# EAGLE schematic SE-Exp30 (EAGLE 9.6.2)
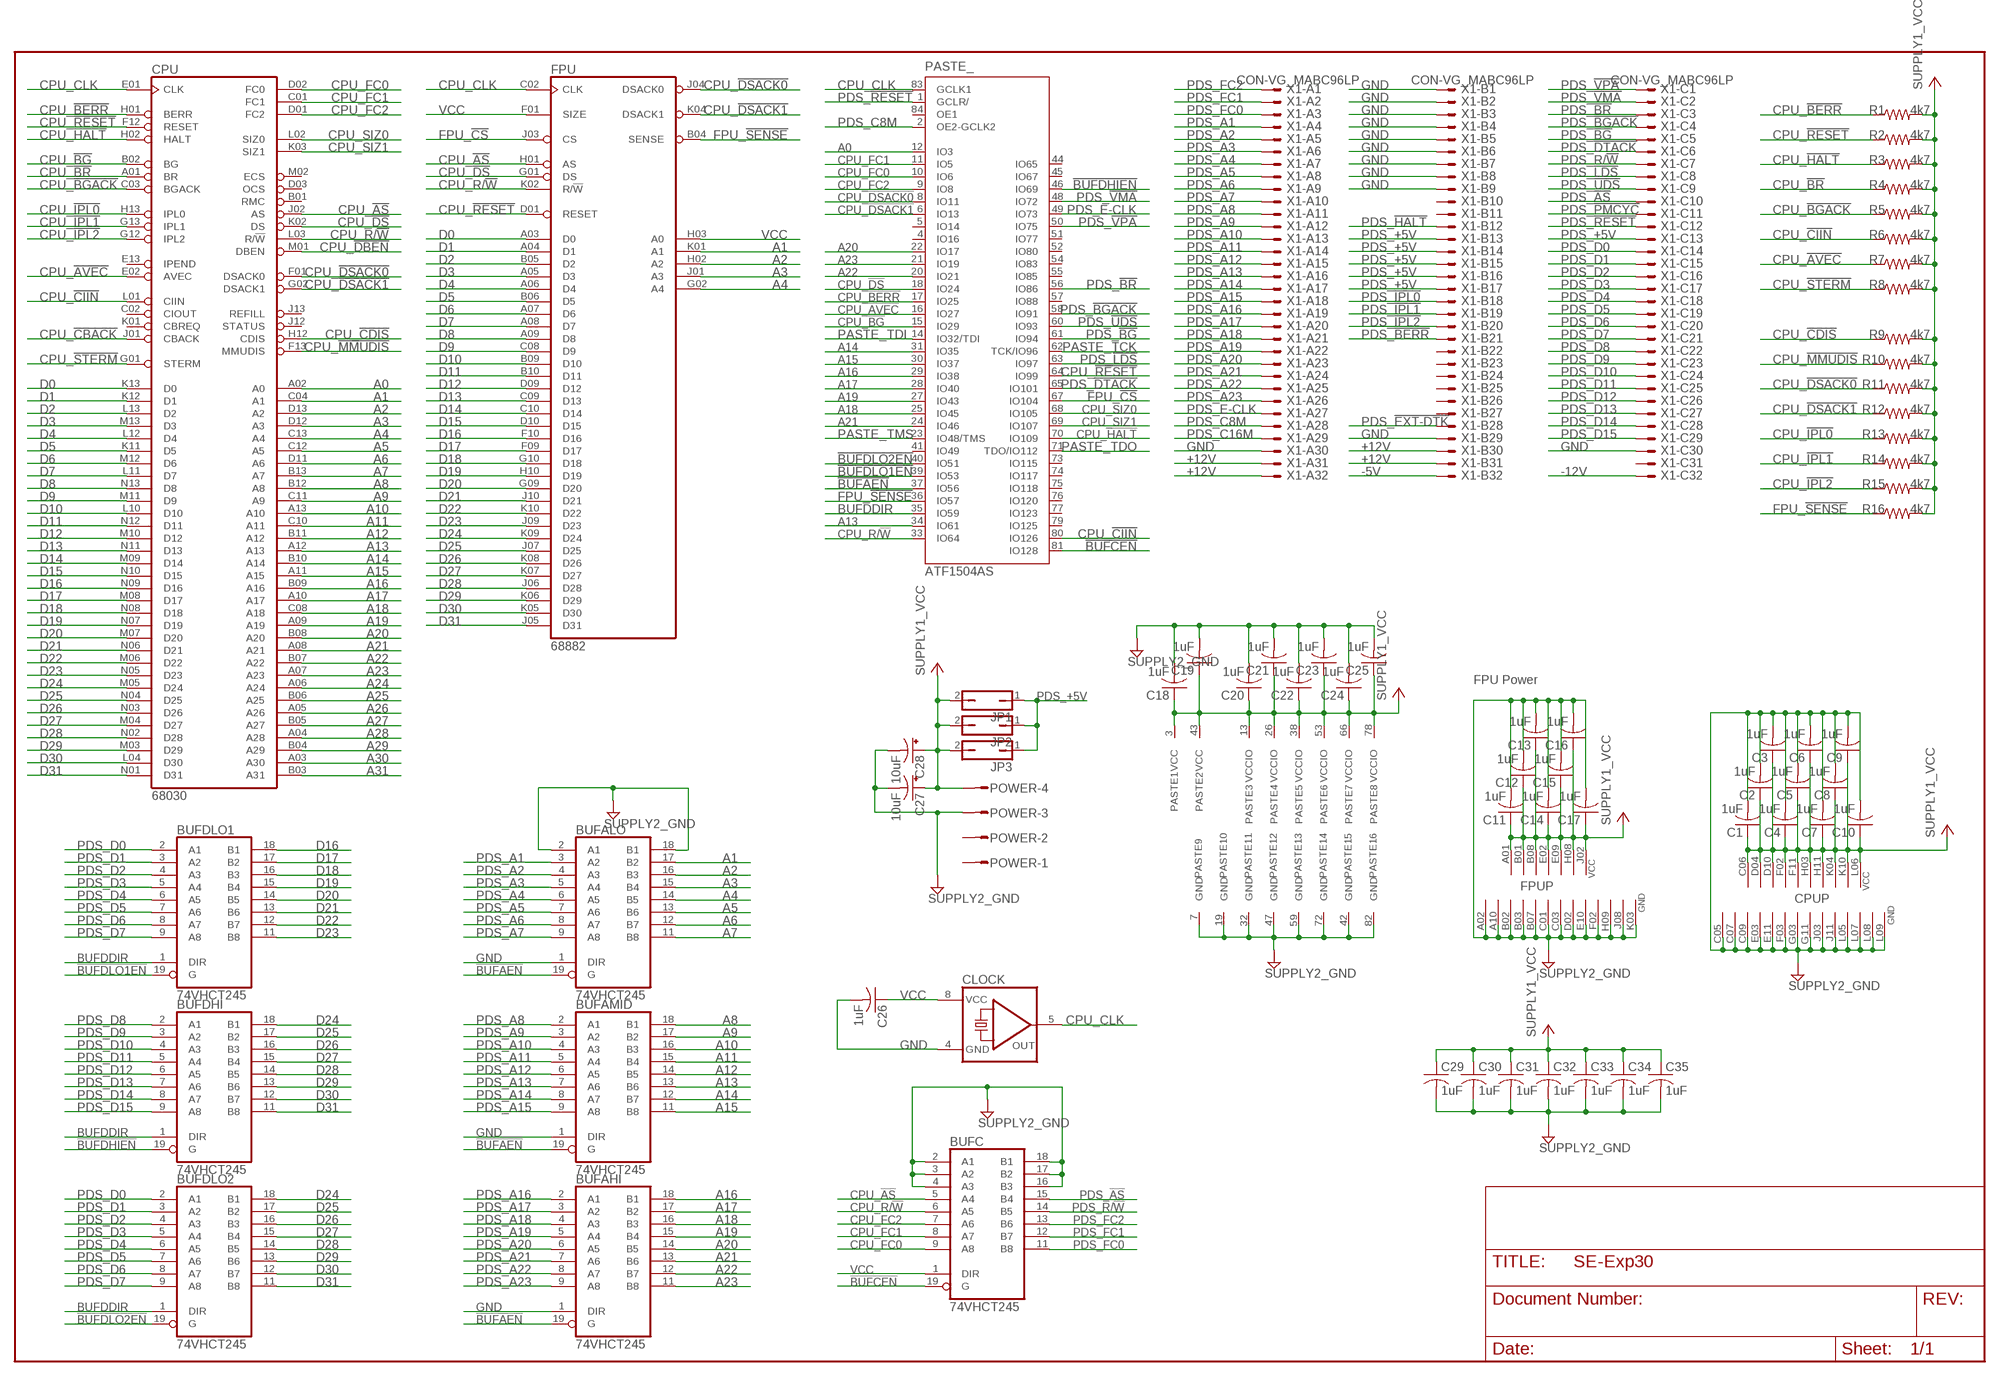
[diagram p0: schematic, sheet 1]

## Parts
BUFAHI  74VHCT245  74XX-US_74LS245DW  [74XX-US_SO20W]
BUFALO  74VHCT245  74XX-US_74LS245DW  [74XX-US_SO20W]
BUFAMID  74VHCT245  74XX-US_74LS245DW  [74XX-US_SO20W]
BUFC  74VHCT245  74XX-US_74LS245DW  [74XX-US_SO20W]
BUFDHI  74VHCT245  74XX-US_74LS245DW  [74XX-US_SO20W]
BUFDLO1  74VHCT245  74XX-US_74LS245DW  [74XX-US_SO20W]
BUFDLO2  74VHCT245  74XX-US_74LS245DW  [74XX-US_SO20W]
C1  1uF  RCL_C-USC0805  [RCL_C0805]
C2  1uF  RCL_C-USC0805  [RCL_C0805]
C3  1uF  RCL_C-USC0805  [RCL_C0805]
C4  1uF  RCL_C-USC0805  [RCL_C0805]
C5  1uF  RCL_C-USC0805  [RCL_C0805]
C6  1uF  RCL_C-USC0805  [RCL_C0805]
C7  1uF  RCL_C-USC0805  [RCL_C0805]
C8  1uF  RCL_C-USC0805  [RCL_C0805]
C9  1uF  RCL_C-USC0805  [RCL_C0805]
C10  1uF  RCL_C-USC0805  [RCL_C0805]
C11  1uF  RCL_C-USC0805  [RCL_C0805]
C12  1uF  RCL_C-USC0805  [RCL_C0805]
C13  1uF  RCL_C-USC0805  [RCL_C0805]
C14  1uF  RCL_C-USC0805  [RCL_C0805]
C15  1uF  RCL_C-USC0805  [RCL_C0805]
C16  1uF  RCL_C-USC0805  [RCL_C0805]
C17  1uF  RCL_C-USC0805  [RCL_C0805]
C18  1uF  RCL_C-USC0805  [RCL_C0805]
C19  1uF  RCL_C-USC0805  [RCL_C0805]
C20  1uF  RCL_C-USC0805  [RCL_C0805]
C21  1uF  RCL_C-USC0805  [RCL_C0805]
C22  1uF  RCL_C-USC0805  [RCL_C0805]
C23  1uF  RCL_C-USC0805  [RCL_C0805]
C24  1uF  RCL_C-USC0805  [RCL_C0805]
C25  1uF  RCL_C-USC0805  [RCL_C0805]
C26  1uF  RCL_C-USC0805  [RCL_C0805]
C27  10uF  RCL_CPOL-USE2.5-5  [RCL_E2,5-5]
C28  10uF  RCL_CPOL-USE2.5-5  [RCL_E2,5-5]
C29  1uF  RCL_C-USC0805  [RCL_C0805]
C30  1uF  RCL_C-USC0805  [RCL_C0805]
C31  1uF  RCL_C-USC0805  [RCL_C0805]
C32  1uF  RCL_C-USC0805  [RCL_C0805]
C33  1uF  RCL_C-USC0805  [RCL_C0805]
C34  1uF  RCL_C-USC0805  [RCL_C0805]
C35  1uF  RCL_C-USC0805  [RCL_C0805]
CLOCK  CRYSTAL_QG5460  [CRYSTAL_DIL08S]
CPU  68030  MICRO-MC68000_MC68030RC  [MICRO-MC68000_MPGA128]
FPU  68882  MICRO-MC68000_MC68881RC  [MICRO-MC68000_MPGA68]
JP1  JUMPER_JP1Q  [JUMPER_JP1]
JP2  JUMPER_JP1Q  [JUMPER_JP1]
JP3  JUMPER_JP1Q  [JUMPER_JP1]
PASTE  ATF1504AS  SE-EXP30_EPM7128-J84S  [SE-EXP30_S84]
POWER  CON-AMP-MT_L04P  [CON-AMP-MT_L04P]
R1  4k7  RCL_R-US_R0805  [RCL_R0805]
R2  4k7  RCL_R-US_R0805  [RCL_R0805]
R3  4k7  RCL_R-US_R0805  [RCL_R0805]
R4  4k7  RCL_R-US_R0805  [RCL_R0805]
R5  4k7  RCL_R-US_R0805  [RCL_R0805]
R6  4k7  RCL_R-US_R0805  [RCL_R0805]
R7  4k7  RCL_R-US_R0805  [RCL_R0805]
R8  4k7  RCL_R-US_R0805  [RCL_R0805]
R9  4k7  RCL_R-US_R0805  [RCL_R0805]
R10  4k7  RCL_R-US_R0805  [RCL_R0805]
R11  4k7  RCL_R-US_R0805  [RCL_R0805]
R12  4k7  RCL_R-US_R0805  [RCL_R0805]
R13  4k7  RCL_R-US_R0805  [RCL_R0805]
R14  4k7  RCL_R-US_R0805  [RCL_R0805]
R15  4k7  RCL_R-US_R0805  [RCL_R0805]
R16  4k7  RCL_R-US_R0805  [RCL_R0805]
X1  CON-VG_MABC96LP  [CON-VG_MABC96LP]

## Nets
!BUFAEN: BUFAHI.19(G) BUFALO.19(G) BUFAMID.19(G) PASTE.37(_:IO56)
!BUFCEN: BUFC.19(G) PASTE.81(_:IO128)
!BUFDHIEN: BUFDHI.19(G) PASTE.46(_:IO69)
!BUFDLO1EN: BUFDLO1.19(G) PASTE.39(_:IO53)
!BUFDLO2EN: BUFDLO2.19(G) PASTE.40(_:IO51)
+12V: X1.A31 X1.A32 X1.B30 X1.B31
-5V: X1.B32
-12V: X1.C32
A0: CPU.A02(A0) PASTE.12(_:IO3)
A1: BUFALO.17(B2) CPU.C04(A1) FPU.K01(A1)
A2: BUFALO.16(B3) CPU.D13(A2) FPU.H02(A2)
A3: BUFALO.15(B4) CPU.D12(A3) FPU.J01(A3)
A4: BUFALO.14(B5) CPU.C13(A4) FPU.G02(A4)
A5: BUFALO.13(B6) CPU.C12(A5)
A6: BUFALO.12(B7) CPU.D11(A6)
A7: BUFALO.11(B8) CPU.B13(A7)
A8: BUFAMID.18(B1) CPU.B12(A8)
A9: BUFAMID.17(B2) CPU.C11(A9)
A10: BUFAMID.16(B3) CPU.A13(A10)
A11: BUFAMID.15(B4) CPU.C10(A11)
A12: BUFAMID.14(B5) CPU.B11(A12)
A13: BUFAMID.13(B6) CPU.A12(A13) PASTE.34(_:IO61)
A14: BUFAMID.12(B7) CPU.B10(A14) PASTE.31(_:IO35)
A15: BUFAMID.11(B8) CPU.A11(A15) PASTE.30(_:IO37)
A16: BUFAHI.18(B1) CPU.B09(A16) PASTE.29(_:IO38)
A17: BUFAHI.17(B2) CPU.A10(A17) PASTE.28(_:IO40)
A18: BUFAHI.16(B3) CPU.C08(A18) PASTE.25(_:IO45)
A19: BUFAHI.15(B4) CPU.A09(A19) PASTE.27(_:IO43)
A20: BUFAHI.14(B5) CPU.B08(A20) PASTE.22(_:IO17)
A21: BUFAHI.13(B6) CPU.A08(A21) PASTE.24(_:IO46)
A22: BUFAHI.12(B7) CPU.B07(A22) PASTE.20(_:IO21)
A23: BUFAHI.11(B8) CPU.A07(A23) PASTE.21(_:IO19)
A24: CPU.A06(A24)
A25: CPU.B06(A25)
A26: CPU.A05(A26)
A27: CPU.B05(A27)
A28: CPU.A04(A28)
A29: CPU.B04(A29)
A30: CPU.A03(A30)
A31: CPU.B03(A31)
BUFDDIR: BUFDHI.1(DIR) BUFDLO1.1(DIR) BUFDLO2.1(DIR) PASTE.35(_:IO59)
CPU_!AS: BUFC.5(A4) CPU.J02(AS) FPU.H01(AS)
CPU_!AVEC: CPU.E02(AVEC) PASTE.16(_:IO27) R7.1
CPU_!BERR: CPU.H01(BERR) PASTE.17(_:IO25) R1.1
CPU_!BG: CPU.B02(BG) PASTE.15(_:IO29)
CPU_!BGACK: CPU.C03(BGACK) R5.1
CPU_!BR: CPU.A01(BR) R4.1
CPU_!CBACK: CPU.J01(CBACK)
CPU_!CDIS: CPU.H12(CDIS) R9.1
CPU_!CIIN: CPU.L01(CIIN) PASTE.80(_:IO126) R6.1
CPU_!DBEN: CPU.M01(DBEN)
CPU_!DS: CPU.K02(DS) FPU.G01(DS) PASTE.18(_:IO24)
CPU_!DSACK0: CPU.F01(DSACK0) FPU.J04(DSACK0) PASTE.8(_:IO11) R11.1
CPU_!DSACK1: CPU.G02(DSACK1) FPU.K04(DSACK1) PASTE.6(_:IO13) R12.1
CPU_!HALT: CPU.H02(HALT) PASTE.70(_:IO109) R3.1
CPU_!IPL0: CPU.H13(IPL0) R13.1
CPU_!IPL1: CPU.G13(IPL1) R14.1
CPU_!IPL2: CPU.G12(IPL2) R15.1
CPU_!MMUDIS: CPU.F13(MMUDIS) R10.1
CPU_!RESET: CPU.F12(RESET) FPU.D01(RESET) PASTE.64(_:IO99) R2.1
CPU_!STERM: CPU.G01(STERM) R8.1
CPU_CLK: CLOCK.5(OUT) CPU.E01(CLK) FPU.C02(CLK) PASTE.83(_:GCLK1)
CPU_FC0: BUFC.9(A8) CPU.D02(FC0) PASTE.10(_:IO6)
CPU_FC1: BUFC.8(A7) CPU.C01(FC1) PASTE.11(_:IO5)
CPU_FC2: BUFC.7(A6) CPU.D01(FC2) PASTE.9(_:IO8)
CPU_R/!W: BUFC.6(A5) CPU.L03(R/!W) FPU.K02(R/!W) PASTE.33(_:IO64)
CPU_SIZ0: CPU.L02(SIZ0) PASTE.68(_:IO105)
CPU_SIZ1: CPU.K03(SIZ1) PASTE.69(_:IO107)
D0: CPU.K13(D0) FPU.A03(D0)
D1: CPU.K12(D1) FPU.A04(D1)
D2: CPU.L13(D2) FPU.B05(D2)
D3: CPU.M13(D3) FPU.A05(D3)
D4: CPU.L12(D4) FPU.A06(D4)
D5: CPU.K11(D5) FPU.B06(D5)
D6: CPU.M12(D6) FPU.A07(D6)
D7: CPU.L11(D7) FPU.A08(D7)
D8: CPU.N13(D8) FPU.A09(D8)
D9: CPU.M11(D9) FPU.C08(D9)
D10: CPU.L10(D10) FPU.B09(D10)
D11: CPU.N12(D11) FPU.B10(D11)
D12: CPU.M10(D12) FPU.D09(D12)
D13: CPU.N11(D13) FPU.C09(D13)
D14: CPU.M09(D14) FPU.C10(D14)
D15: CPU.N10(D15) FPU.D10(D15)
D16: BUFDLO1.18(B1) CPU.N09(D16) FPU.F10(D16)
D17: BUFDLO1.17(B2) CPU.M08(D17) FPU.F09(D17)
D18: BUFDLO1.16(B3) CPU.N08(D18) FPU.G10(D18)
D19: BUFDLO1.15(B4) CPU.N07(D19) FPU.H10(D19)
D20: BUFDLO1.14(B5) CPU.M07(D20) FPU.G09(D20)
D21: BUFDLO1.13(B6) CPU.N06(D21) FPU.J10(D21)
D22: BUFDLO1.12(B7) CPU.M06(D22) FPU.K10(D22)
D23: BUFDLO1.11(B8) CPU.N05(D23) FPU.J09(D23)
D24: BUFDHI.18(B1) BUFDLO2.18(B1) CPU.M05(D24) FPU.K09(D24)
D25: BUFDHI.17(B2) BUFDLO2.17(B2) CPU.N04(D25) FPU.J07(D25)
D26: BUFDHI.16(B3) BUFDLO2.16(B3) CPU.N03(D26) FPU.K08(D26)
D27: BUFDHI.15(B4) BUFDLO2.15(B4) CPU.M04(D27) FPU.K07(D27)
D28: BUFDHI.14(B5) BUFDLO2.14(B5) CPU.N02(D28) FPU.J06(D28)
D29: BUFDHI.13(B6) BUFDLO2.13(B6) CPU.M03(D29) FPU.K06(D29)
D30: BUFDHI.12(B7) BUFDLO2.12(B7) CPU.L04(D30) FPU.K05(D30)
D31: BUFDHI.11(B8) BUFDLO2.11(B8) CPU.N01(D31) FPU.J05(D31)
FPU_!CS: FPU.J03(CS) PASTE.67(_:IO104)
FPU_!SENSE: FPU.B04(SENSE) PASTE.36(_:IO57) R16.1
GND: BUFAHI.1(DIR) BUFALO.1(DIR) BUFALO.2(A1) BUFALO.18(B1) BUFAMID.1(DIR) BUFC.2(A1) BUFC.3(A2) BUFC.4(A3) BUFC.16(B3) BUFC.17(B2) BUFC.18(B1) C1.2 C2.2 C3.2 C4.2 C5.2 C6.2 C7.2 C8.2 C9.2 C10.2 C11.2 C12.2 C13.2 C14.2 C15.2 C16.2 C17.2 C18.2 C19.2 C20.2 C21.2 C22.2 C23.2 C24.2 C25.2 C26.2 C27.- C28.- C29.2 C30.2 C31.2 C32.2 C33.2 C34.2 C35.2 CLOCK.4(GND) CPU.C05(GND) CPU.C07(GND) CPU.C09(GND) CPU.E03(GND) CPU.E11(GND) CPU.F03(GND) CPU.G03(GND) CPU.G11(GND) CPU.J03(GND) CPU.J11(GND) CPU.L05(GND) CPU.L07(GND) CPU.L08(GND) CPU.L09(GND) FPU.A02(GND) FPU.A10(GND) FPU.B02(GND) FPU.B03(GND) FPU.B07(GND) FPU.C01(GND) FPU.C03(GND) FPU.D02(GND) FPU.E10(GND) FPU.F02(GND) FPU.H09(GND) FPU.J08(GND) FPU.K03(GND) PASTE.7(9:GND) PASTE.19(10:GND) PASTE.32(11:GND) PASTE.42(15:GND) PASTE.47(12:GND) PASTE.59(13:GND) PASTE.72(14:GND) PASTE.82(16:GND) POWER.3 X1.A30 X1.B1 X1.B2 X1.B3 X1.B4 X1.B5 X1.B6 X1.B7 X1.B8 X1.B9 X1.B29 X1.C30 ; supply symbol labelled SUPPLY2_GND
PASTE_TCK: PASTE.62(_:TCK/IO96)
PASTE_TDI: PASTE.14(_:IO32/TDI)
PASTE_TDO: PASTE.71(_:TDO/IO112)
PASTE_TMS: PASTE.23(_:IO48/TMS)
PDS_!AS: BUFC.15(B4) X1.C10
PDS_!BERR: X1.B21
PDS_!BG: PASTE.61(_:IO94) X1.C5
PDS_!BGACK: PASTE.58(_:IO91) X1.C4
PDS_!BR: PASTE.56(_:IO86) X1.C3
PDS_!DTACK: PASTE.65(_:IO101) X1.C6
PDS_!EXT-DTK: X1.B28
PDS_!HALT: X1.B12
PDS_!IPL0: X1.B18
PDS_!IPL1: X1.B19
PDS_!IPL2: X1.B20
PDS_!LDS: PASTE.63(_:IO97) X1.C8
PDS_!PMCYC: X1.C11
PDS_!RESET: PASTE.1(_:GCLR/) X1.C12
PDS_!UDS: PASTE.60(_:IO93) X1.C9
PDS_!VMA: PASTE.48(_:IO72) X1.C2
PDS_!VPA: PASTE.50(_:IO75) X1.C1
PDS_+5V: JP1.1 JP2.1 JP3.1 X1.B13 X1.B14 X1.B15 X1.B16 X1.B17 X1.C13
PDS_A1: BUFALO.3(A2) X1.A4
PDS_A2: BUFALO.4(A3) X1.A5
PDS_A3: BUFALO.5(A4) X1.A6
PDS_A4: BUFALO.6(A5) X1.A7
PDS_A5: BUFALO.7(A6) X1.A8
PDS_A6: BUFALO.8(A7) X1.A9
PDS_A7: BUFALO.9(A8) X1.A10
PDS_A8: BUFAMID.2(A1) X1.A11
PDS_A9: BUFAMID.3(A2) X1.A12
PDS_A10: BUFAMID.4(A3) X1.A13
PDS_A11: BUFAMID.5(A4) X1.A14
PDS_A12: BUFAMID.6(A5) X1.A15
PDS_A13: BUFAMID.7(A6) X1.A16
PDS_A14: BUFAMID.8(A7) X1.A17
PDS_A15: BUFAMID.9(A8) X1.A18
PDS_A16: BUFAHI.2(A1) X1.A19
PDS_A17: BUFAHI.3(A2) X1.A20
PDS_A18: BUFAHI.4(A3) X1.A21
PDS_A19: BUFAHI.5(A4) X1.A22
PDS_A20: BUFAHI.6(A5) X1.A23
PDS_A21: BUFAHI.7(A6) X1.A24
PDS_A22: BUFAHI.8(A7) X1.A25
PDS_A23: BUFAHI.9(A8) X1.A26
PDS_C8M: PASTE.2(_:OE2-GCLK2) X1.A28
PDS_C16M: X1.A29
PDS_D0: BUFDLO1.2(A1) BUFDLO2.2(A1) X1.C14
PDS_D1: BUFDLO1.3(A2) BUFDLO2.3(A2) X1.C15
PDS_D2: BUFDLO1.4(A3) BUFDLO2.4(A3) X1.C16
PDS_D3: BUFDLO1.5(A4) BUFDLO2.5(A4) X1.C17
PDS_D4: BUFDLO1.6(A5) BUFDLO2.6(A5) X1.C18
PDS_D5: BUFDLO1.7(A6) BUFDLO2.7(A6) X1.C19
PDS_D6: BUFDLO1.8(A7) BUFDLO2.8(A7) X1.C20
PDS_D7: BUFDLO1.9(A8) BUFDLO2.9(A8) X1.C21
PDS_D8: BUFDHI.2(A1) X1.C22
PDS_D9: BUFDHI.3(A2) X1.C23
PDS_D10: BUFDHI.4(A3) X1.C24
PDS_D11: BUFDHI.5(A4) X1.C25
PDS_D12: BUFDHI.6(A5) X1.C26
PDS_D13: BUFDHI.7(A6) X1.C27
PDS_D14: BUFDHI.8(A7) X1.C28
PDS_D15: BUFDHI.9(A8) X1.C29
PDS_E-CLK: PASTE.49(_:IO73) X1.A27
PDS_FC0: BUFC.11(B8) X1.A3
PDS_FC1: BUFC.12(B7) X1.A2
PDS_FC2: BUFC.13(B6) X1.A1
PDS_R/!W: BUFC.14(B5) X1.C7
VCC: BUFC.1(DIR) C1.1 C2.1 C3.1 C4.1 C5.1 C6.1 C7.1 C8.1 C9.1 C10.1 C11.1 C12.1 C13.1 C14.1 C15.1 C16.1 C17.1 C18.1 C19.1 C20.1 C21.1 C22.1 C23.1 C24.1 C25.1 C26.1 C27.+ C28.+ C29.1 C30.1 C31.1 C32.1 C33.1 C34.1 C35.1 CLOCK.8(VCC) CPU.C06(VCC) CPU.D04(VCC) CPU.D10(VCC) CPU.F02(VCC) CPU.F11(VCC) CPU.H03(VCC) CPU.H11(VCC) CPU.K04(VCC) CPU.K10(VCC) CPU.L06(VCC) FPU.A01(VCC) FPU.B01(VCC) FPU.B08(VCC) FPU.E02(VCC) FPU.E09(VCC) FPU.F01(SIZE) FPU.H03(A0) FPU.H08(VCC) FPU.J02(VCC) JP1.2 JP2.2 JP3.2 PASTE.3(1:VCC) PASTE.13(3:VCCIO) PASTE.26(4:VCCIO) PASTE.38(5:VCCIO) PASTE.43(2:VCC) PASTE.53(6:VCCIO) PASTE.66(7:VCCIO) PASTE.78(8:VCCIO) POWER.4 R1.2 R2.2 R3.2 R4.2 R5.2 R6.2 R7.2 R8.2 R9.2 R10.2 R11.2 R12.2 R13.2 R14.2 R15.2 R16.2 ; supply symbol labelled SUPPLY1_VCC
Unconnected: CPU.B01(RMC) CPU.C02(CIOUT) CPU.D03(OCS) CPU.E13(IPEND) CPU.J12(STATUS) CPU.J13(REFILL) CPU.K01(CBREQ) CPU.M02(ECS) PASTE.4(_:IO16) PASTE.5(_:IO14) PASTE.41(_:IO49) PASTE.44(_:IO65) PASTE.45(_:IO67) PASTE.51(_:IO77) PASTE.52(_:IO80) PASTE.54(_:IO83) PASTE.55(_:IO85) PASTE.57(_:IO88) PASTE.73(_:IO115) PASTE.74(_:IO117) PASTE.75(_:IO118) PASTE.76(_:IO120) PASTE.77(_:IO123) PASTE.79(_:IO125) PASTE.84(_:OE1) POWER.1 POWER.2 X1.B10 X1.B11 X1.B22 X1.B23 X1.B24 X1.B25 X1.B26 X1.B27 X1.C31

## Notes on the sheet
- FPU Power

## Power pins joined to a net without a drawn wire
GND: BUFAHI.10(GND) BUFALO.10(GND) BUFAMID.10(GND) BUFC.10(GND) BUFDHI.10(GND) BUFDLO1.10(GND) BUFDLO2.10(GND)
VCC: BUFAHI.20(VCC) BUFALO.20(VCC) BUFAMID.20(VCC) BUFC.20(VCC) BUFDHI.20(VCC) BUFDLO1.20(VCC) BUFDLO2.20(VCC)

## Library data of the parts
BUFAHI BUFALO BUFAMID BUFC BUFDHI BUFDLO1 BUFDLO2 = SE-Exp30_20210325:74XX-US_74*245: Octal BUS TRANSCEIVER, 3-state
C1-C26 C29-C35 = SE-Exp30_20210325:RCL_C-US: CAPACITOR, American symbol; SPICEPREFIX: C
C27 C28 = SE-Exp30_20210325:RCL_CPOL-US: POLARIZED CAPACITOR, American symbol; SPICEPREFIX: C
CLOCK = SE-Exp30_20210325:CRYSTAL_QG5460: CRYSTAL RESONATOR; OC_FARNELL: unknown; OC_NEWARK: unknown
CPU = SE-Exp30_20210325:MICRO-MC68000_MC68030RC: 68xxx PROCESSOR; MF: MOTOROLA; MPN: MC68030RC50C; OC_FARNELL: unknown; OC_NEWARK: 52F3269
FPU = SE-Exp30_20210325:MICRO-MC68000_MC68881RC: 68xxx PROCESSOR; OC_FARNELL: unknown; OC_NEWARK: unknown
JP1-JP3 = SE-Exp30_20210325:JUMPER_JP1Q: JUMPER
PASTE = SE-Exp30_20210325:SE-EXP30_EPM7128-J84: EPM70128 MAX 7000 family
POWER = SE-Exp30_20210325:CON-AMP-MT_L04P: AMP MT CONNECTOR; OC_FARNELL: unknown; OC_NEWARK: unknown
R1-R16 = SE-Exp30_20210325:RCL_R-US_: RESISTOR, American symbol; SPICEPREFIX: R
X1 = SE-Exp30_20210325:CON-VG_MABC96LP: CONNECTOR male, 96 pins, type C, rows ABC, grid 2.54 mm with mounting clip